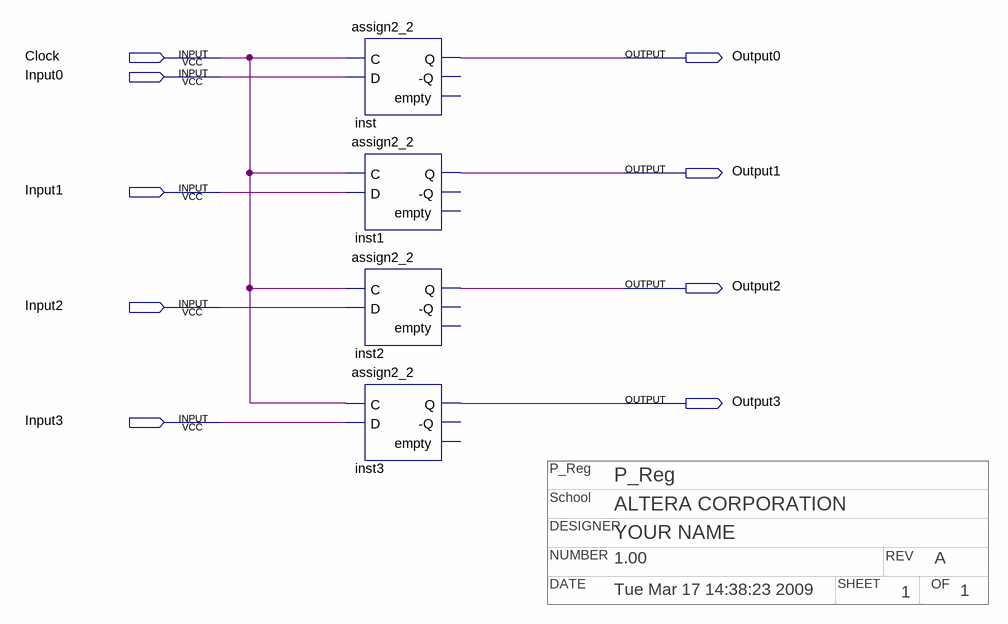
[diagram p0: schematic sheet]
// Quartus schematic assign2_3.bdf as structural Verilog: 4 symbols, 9 pins
// Title block: P_Reg: P_Reg; School: ALTERA CORPORATION; DESIGNER: YOUR NAME; NUMBER: 1.00; REV: A; DATE: Tue Mar 17 14:38:23 2009; SHEET: 1; OF: 1
module assign2_3 (
  input  Clock,
  input  Input0,
  input  Input1,
  input  Input2,
  input  Input3,
  output Output0,
  output Output1,
  output Output2,
  output Output3
);

  assign2_2 inst (.C(Clock), .D(Input0), .Q(Output0));  // open: -Q, empty
  assign2_2 inst1 (.C(Clock), .D(Input1), .Q(Output1));  // open: -Q, empty
  assign2_2 inst2 (.C(Clock), .D(Input2), .Q(Output2));  // open: -Q, empty
  assign2_2 inst3 (.C(Clock), .D(Input3), .Q(Output3));  // open: -Q, empty
endmodule
